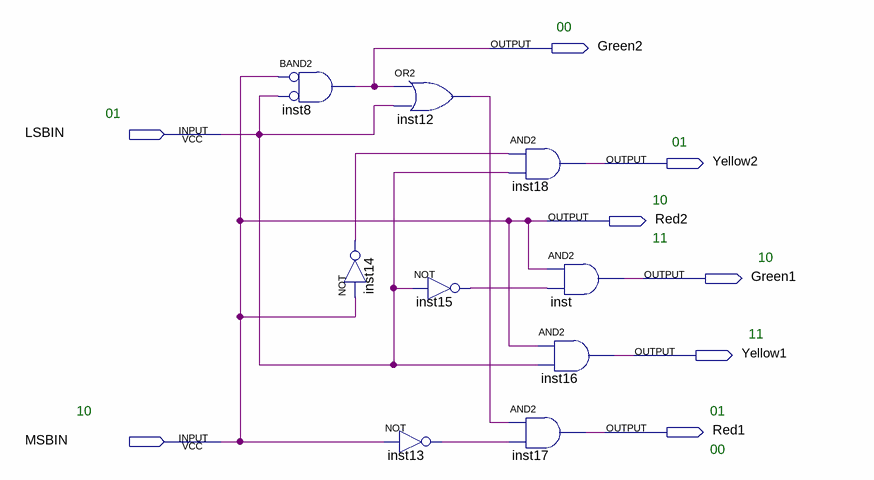
[diagram p0: schematic sheet]
// Quartus schematic DECFarolSecondary.bdf as structural Verilog: 9 symbols, 8 pins
module DECFarolSecondary (
  input  LSBIN,
  input  MSBIN,
  output Green2,
  output Yellow2,
  output Red2,
  output Green1,
  output Yellow1,
  output Red1
);

  wire inst12_out, inst13_out, inst14_out, inst15_out;

  and inst8 (Green2, ~MSBIN, ~LSBIN);  // BAND2
  not inst14 (inst14_out, MSBIN);
  or inst12 (inst12_out, Green2, LSBIN);
  not inst15 (inst15_out, LSBIN);
  not inst13 (inst13_out, MSBIN);
  and inst18 (Yellow2, inst14_out, LSBIN);
  and inst17 (Red1, inst12_out, inst13_out);
  and inst (Green1, MSBIN, inst15_out);
  and inst16 (Yellow1, MSBIN, LSBIN);

  assign Red2 = MSBIN;

  // Notes on the sheet:
  //   00
  //   01
  //   01
  //   10
  //   11
  //   10
  //   11
  //   10
  //   01
  //   00
endmodule
